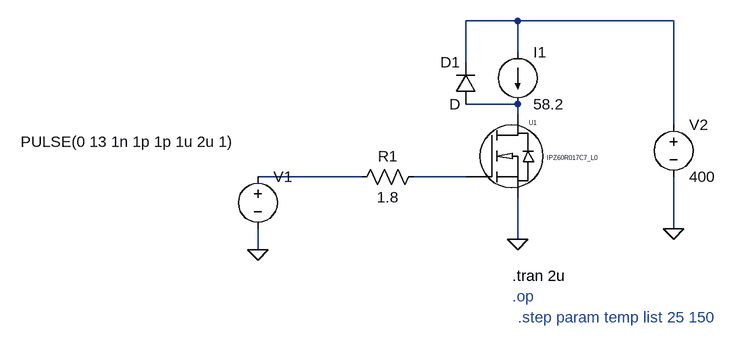
[diagram p0: schematic Slow_leg_validation.asc]
Slow_leg_validation.asc, the LTspice schematic file:
Version 4.1
SHEET 1 880 680
WIRE 144 -48 64 -48
WIRE 384 -48 144 -48
WIRE 144 0 144 -48
WIRE 64 16 64 -48
WIRE 144 80 64 80
WIRE 144 96 144 80
WIRE 384 112 384 -48
WIRE -96 192 -256 192
WIRE 64 192 -16 192
WIRE 384 272 384 192
WIRE 144 288 144 224
WIRE -256 304 -256 272
FLAG 144 288 0
FLAG 384 272 0
FLAG -256 304 0
SYMBOL IPx6xx_L1 64 192 R0
SYMATTR InstName U1
SYMATTR Value IPZ60R017C7_L0
SYMBOL voltage -256 176 R0
WINDOW 3 -365 -38 Left 2
WINDOW 123 0 0 Left 0
WINDOW 39 0 0 Left 0
SYMATTR InstName V1
SYMATTR Value PULSE(0 13 1n 1p 1p 1u 2u 1)
SYMBOL voltage 384 96 R0
WINDOW 123 0 0 Left 0
WINDOW 39 0 0 Left 0
SYMATTR InstName V2
SYMATTR Value 400
SYMBOL current 144 0 R0
WINDOW 123 0 0 Left 0
WINDOW 39 0 0 Left 0
SYMATTR InstName I1
SYMATTR Value 58.2
SYMBOL diode 80 80 R180
WINDOW 0 24 64 Left 2
WINDOW 3 24 0 Left 2
SYMATTR InstName D1
SYMBOL res 0 176 R90
WINDOW 0 0 56 VBottom 2
WINDOW 3 32 56 VTop 2
SYMATTR InstName R1
SYMATTR Value 1.8
TEXT 136 344 Left 2 !.tran 2u
TEXT 136 376 Left 2 ;.op
TEXT 144 408 Left 2 ;.step param temp list 25 150

The netlist it stands for:
* Slow_leg_validation.asc
X§U1 N002 N004 0 IPZ60R017C7_L0  ; pins drain gate source
V1 N003 0 PULSE(0 13 1n 1p 1p 1u 2u 1)
V2 N001 0 400
I1 N001 N002 58.2
D1 N002 N001 D
R1 N004 N003 1.8
.model D D
.lib standard.dio
.tran 2u
* .op
* .step param temp list 25 150
.lib Infineon_SimulationModel_CoolMOS_C7_MOSFET_600V_Spice.lib
.backanno
.end